# EAGLE design Blupill SCSI(a) (EAGLE 7.2.0)
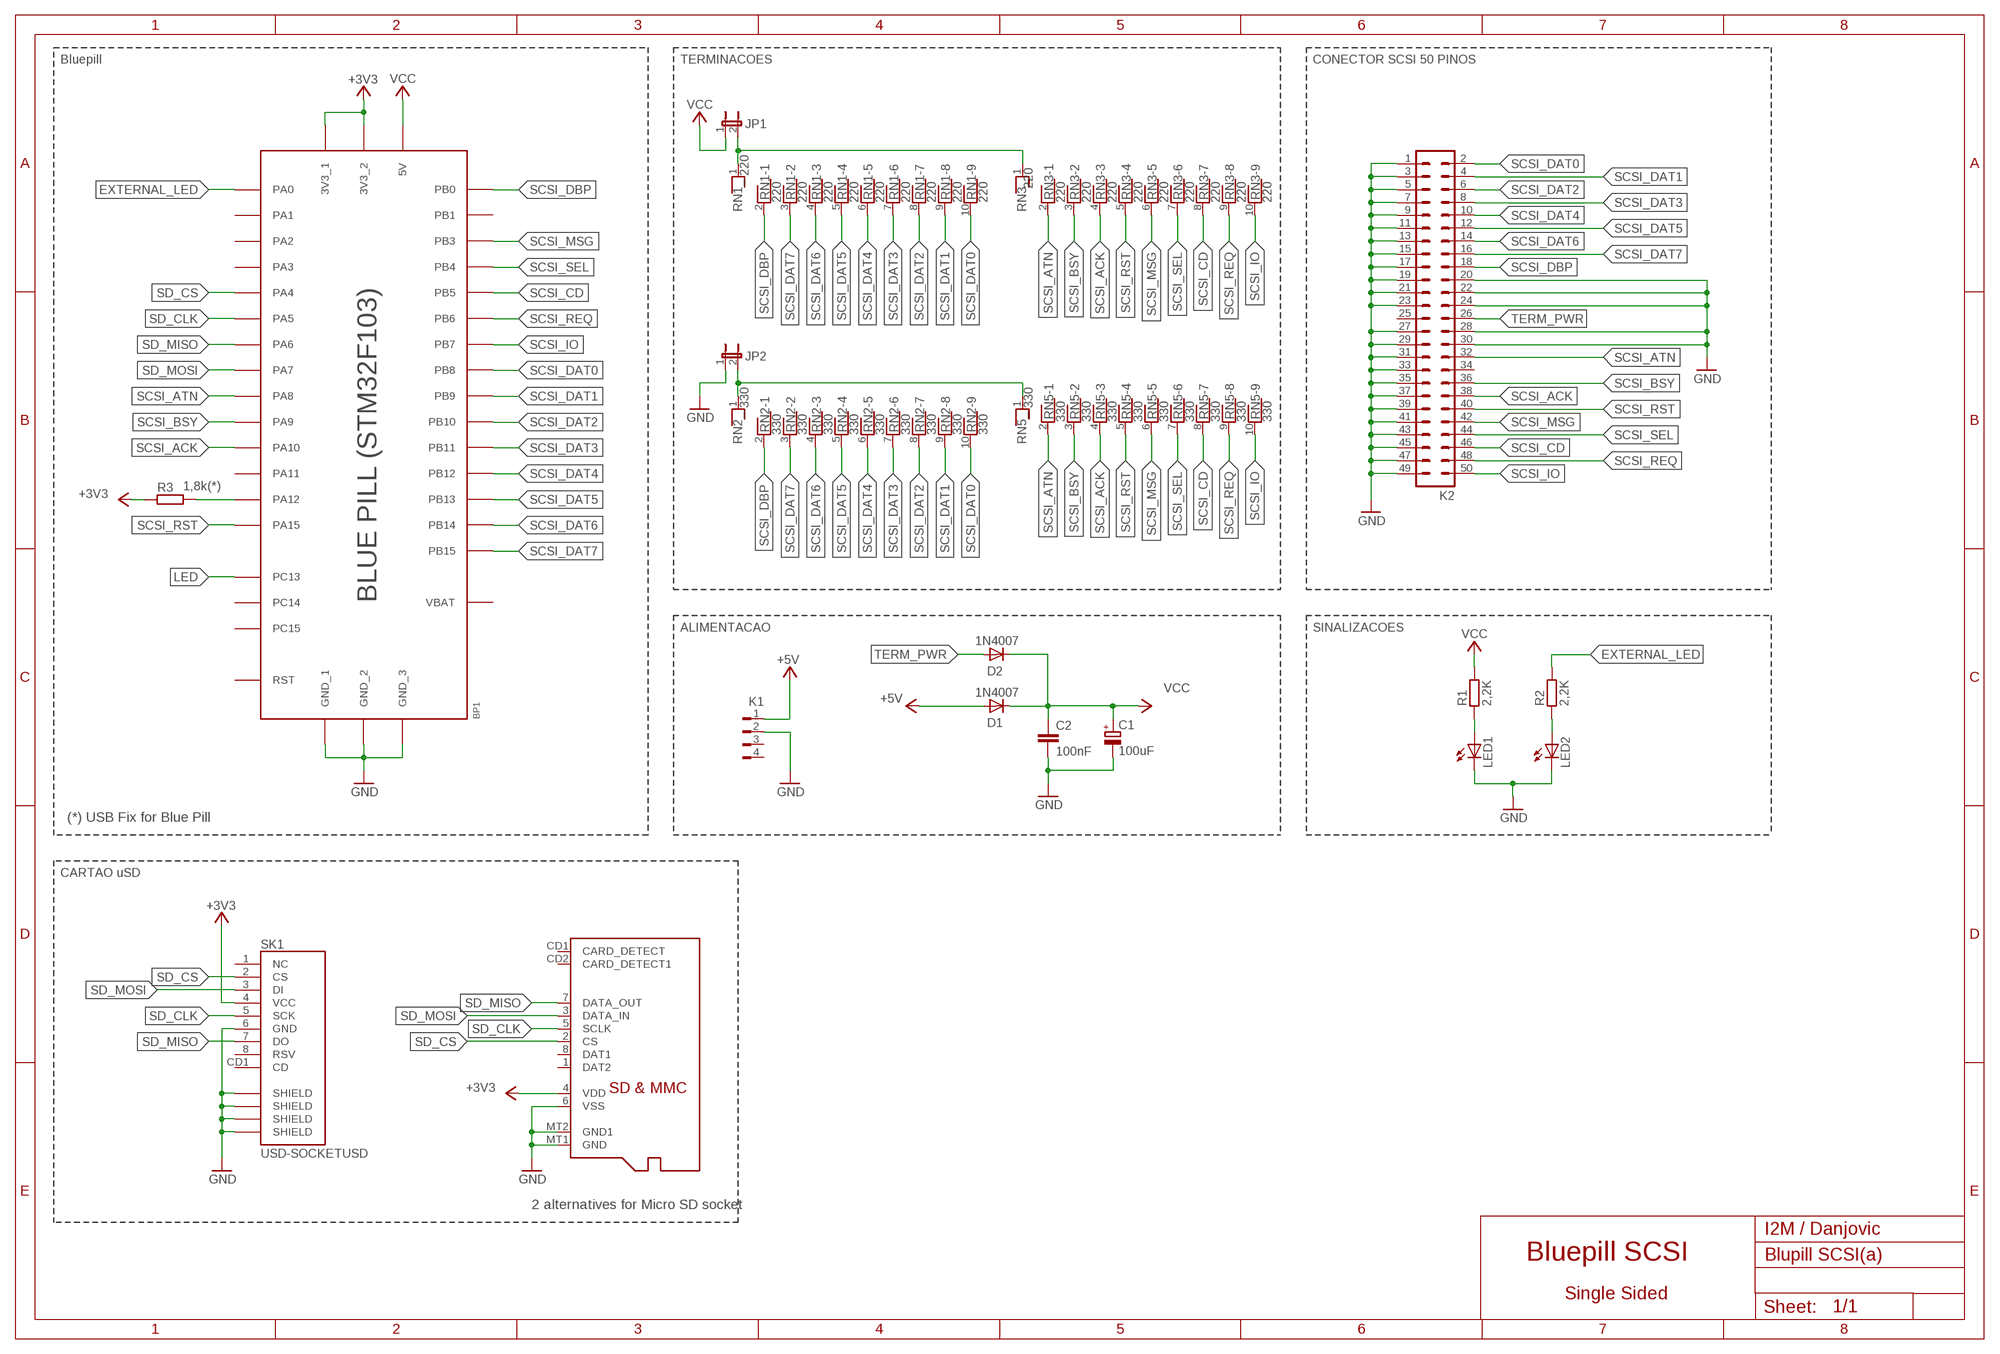
[diagram p0: schematic, sheet 1]

## Parts
BP1  BLUE_PILL  [BLUE_PILL]
C1  100uF  CPOL-EUE2.5-7  [E2,5-7]
C2  100nF  C-EU050-025X075  [C050-025X075]
D1  1N4007  1N4004  [DO41-10]
D2  1N4007  1N4004  [DO41-10]
JP1  JP1E  [JP1]
JP2  JP1E  [JP1]
K1  FLOP-4W  [FLOP-4V]
K2  ML50L  [ML50L]
LED1  LED3MM  [LED3MM]
LED2  LED3MM  [LED3MM]
R1  2,2K  R-EU_0207/10  [0207/10]
R2  2,2K  R-EU_0207/10  [0207/10]
R3  1,8k(*)  R-EU_0207/10  [0207/10]
RN1  220  RNX9  [RN-10]
RN2  330  RNX9  [RN-10]
RN3  220  RNX9  [RN-10]
RN5  330  RNX9  [RN-10]
SK1  USD-SOCKETUSD  [USD-SOCKET-PP]
U$2  MICROSD  [MICROSD]

## Nets
+3V3: BP1.3,3V_1(3V3_1) BP1.3,3V_2(3V3_2) R3.1 SK1.4(VCC) U$2.4(VDD)
+5V: D1.A K1.1
EXTERNAL_LED: BP1.A0 R2.2
GND: BP1.GND1(GND_1) BP1.GND2(GND_2) BP1.GND3(GND_3) C1.- C2.2 JP2.1 K1.2 K2.1 K2.3 K2.5 K2.7 K2.9 K2.11 K2.13 K2.15 K2.17 K2.19 K2.20 K2.21 K2.22 K2.23 K2.24 K2.27 K2.28 K2.29 K2.30 K2.31 K2.33 K2.35 K2.37 K2.39 K2.41 K2.43 K2.45 K2.47 K2.49 LED1.K(C) LED2.K(C) SK1.6(GND) SK1.GND1(SHIELD) SK1.GND2(SHIELD) SK1.GND3(SHIELD) SK1.GND4(SHIELD) U$2.6(VSS) U$2.MT1(GND) U$2.MT2(GND1)
LED: BP1.C13
N$1: JP2.2 RN2.1 RN5.1
N$2: LED1.A R1.1
N$3: LED2.A R2.1
N$4: JP1.2 RN1.1 RN3.1
N$5: BP1.A12 R3.2
SCSI_ACK: BP1.A10 K2.38 RN3.4 RN5.4
SCSI_ATN: BP1.A8 K2.32 RN3.2 RN5.2
SCSI_BSY: BP1.A9 K2.36 RN3.3 RN5.3
SCSI_CD: BP1.B5 K2.46 RN3.8 RN5.8
SCSI_DAT0: BP1.B8 K2.2 RN1.10 RN2.10
SCSI_DAT1: BP1.B9 K2.4 RN1.9 RN2.9
SCSI_DAT2: BP1.B10 K2.6 RN1.8 RN2.8
SCSI_DAT3: BP1.B11 K2.8 RN1.7 RN2.7
SCSI_DAT4: BP1.B12 K2.10 RN1.6 RN2.6
SCSI_DAT5: BP1.B13 K2.12 RN1.5 RN2.5
SCSI_DAT6: BP1.B14 K2.14 RN1.4 RN2.4
SCSI_DAT7: BP1.B15 K2.16 RN1.3 RN2.3
SCSI_DBP: BP1.B0 K2.18 RN1.2 RN2.2
SCSI_IO: BP1.B7 K2.50 RN3.10 RN5.10
SCSI_MSG: BP1.B3 K2.42 RN3.6 RN5.6
SCSI_REQ: BP1.B6 K2.48 RN3.9 RN5.9
SCSI_RST: BP1.A15 K2.40 RN3.5 RN5.5
SCSI_SEL: BP1.B4 K2.44 RN3.7 RN5.7
SD_CLK: BP1.A5 SK1.5(SCK) U$2.5(SCLK)
SD_CS: BP1.A4 SK1.2(CS) U$2.2(CS)
SD_MISO: BP1.A6 SK1.7(DO) U$2.7(DATA_OUT)
SD_MOSI: BP1.A7 SK1.3(DI) U$2.3(DATA_IN)
TERM_PWR: D2.A K2.26
VCC: BP1.5V C1.+ C2.1 D1.C D2.C JP1.1 R1.2
Unconnected: BP1.A1 BP1.A2 BP1.A3 BP1.A11 BP1.B1 BP1.C14 BP1.C15 BP1.RST K1.3 K1.4 K2.25 K2.34 SK1.1(NC) SK1.8(RSV) SK1.CD1(CD) U$2.1(DAT2) U$2.8(DAT1) U$2.CD1(CARD_DETECT) U$2.CD2(CARD_DETECT1)

## Notes on the sheet
- Bluepill | TERMINACOES | CONECTOR SCSI 50 PINOS
- ALIMENTACAO | SINALIZACOES
- (*) USB Fix for Blue Pill
- CARTAO uSD
- 2 alternatives for Micro SD socket
- I2M / Danjovic
- Bluepill SCSI
- Single Sided

## Power pins joined to a net without a drawn wire
VBAT: BP1.VB(VBAT)

## Library data of the parts
BP1 = _diversos:BLUE_PILL: Módulo de desenvolvimento Blue Pill.
C1 = rcl:CPOL-EU: POLARIZED CAPACITOR, European symbol
C2 = rcl:C-EU: CAPACITOR, European symbol
D1 D2 = diode:1N4004: DIODE general purpose rectifier, 1 A
JP1 JP2 = jumper:JP1E: JUMPER
K1 = con-amp:FLOP-4W: MATE N-LOCK Floppy / HDD conector Distributor: Bürklin 71F972
K2 = con-harting-ml:ML50: HARTING
LED1 LED2 = led:LED: LED OSRAM: - CHIPLED LG R971, LG N971, LY N971, LG Q971, LY Q971, LO R971, LY R971 LH N974, LH R974 LS Q976, LO Q976, LY Q976 LO Q996 - Hyper CHIPLED LW Q18S LB Q993, LB Q99A, LB R99A - SideLED LS A670, LO A670, LY A670, LG A670, LP A670 LB A673, LV A673, LT A673, LW A673 LH A674 LY A675 LS A676, LA A676, LO A676, LY A676, LW A676 LS A679, LY A679, LG A679 - Hyper Micro SIDELED® LS Y876, LA Y876, LO Y876, LY Y876 LT Y87S - SmartLED LW L88C, LW L88S LB L89C, LB L89S, LG L890 LS L89K, LO L89K, LY L89K LS L896, LA L896, LO L896, LY L896 - TOPLED LS T670, LO T670, LY T670, LG T670, LP T670 LSG T670, LSP T670, LSY T670, LOP T670, LYG T670 LG T671, LOG T671, LSG T671 LB T673, LV T673, LT T673, LW T673 LH T674 LS T676, LA T676, LO T676, LY T676, LB T676, LH T676, LSB T676, LW T676 LB T67C, LV T67C, LT T67C, LS T67K, LO T67K, LY T67K, LW E67C LS E67B, LA E67B, LO E67B, LY E67B, LB E67C, LV E67C, LT E67C LW T67C LS T679, LY T679, LG T679 LS T770, LO T770, LY T770, LG T770, LP T770 LB T773, LV T773, LT T773, LW T773 LH T774 LS E675, LA E675, LY E675, LS T675 LS T776, LA T776, LO T776, LY T776, LB T776 LHGB T686 LT T68C, LB T68C - Hyper Mini TOPLED® LB M676 - Mini TOPLED Santana® LG M470 LS M47K, LO M47K, LY M47K Source: http://www.osram.convergy.de LUXEON: - LUMILED® LXK2-PW12-R00, LXK2-PW12-S00, LXK2-PW14-U00, LXK2-PW14-V00 LXK2-PM12-R00, LXK2-PM12-S00, LXK2-PM14-U00 LXK2-PE12-Q00, LXK2-PE12-R00, LXK2-PE12-S00, LXK2-PE14-T00, LXK2-PE14-U00 LXK2-PB12-K00, LXK2-PB12-L00, LXK2-PB12-M00, LXK2-PB14-N00, LXK2-PB14-P00, LXK2-PB14-Q00 LXK2-PR12-L00, LXK2-PR12-M00, LXK2-PR14-Q00, LXK2-PR14-R00 LXK2-PD12-Q00, LXK2-PD12-R00, LXK2-PD12-S00 LXK2-PH12-R00, LXK2-PH12-S00 LXK2-PL12-P00, LXK2-PL12-Q00, LXK2-PL12-R00 Source: www.luxeon.com KINGBRIGHT: KA-3528ASYC Source: www.kingbright.com
R1-R3 = rcl:R-EU_: RESISTOR, European symbol
RN1-RN3 RN5 = resistor-net:RNX9: RESISTOR NETWORK
SK1 = _diversos:USD-SOCKET: Footprint do soquete para cartão uSD.
U$2 = adafruit:MICROSD: Micro-SD / Transflash card holder with SPI pinout For the 3M # 2908-05WB-MG and/or 4UCON #19656 push-push type

## Board
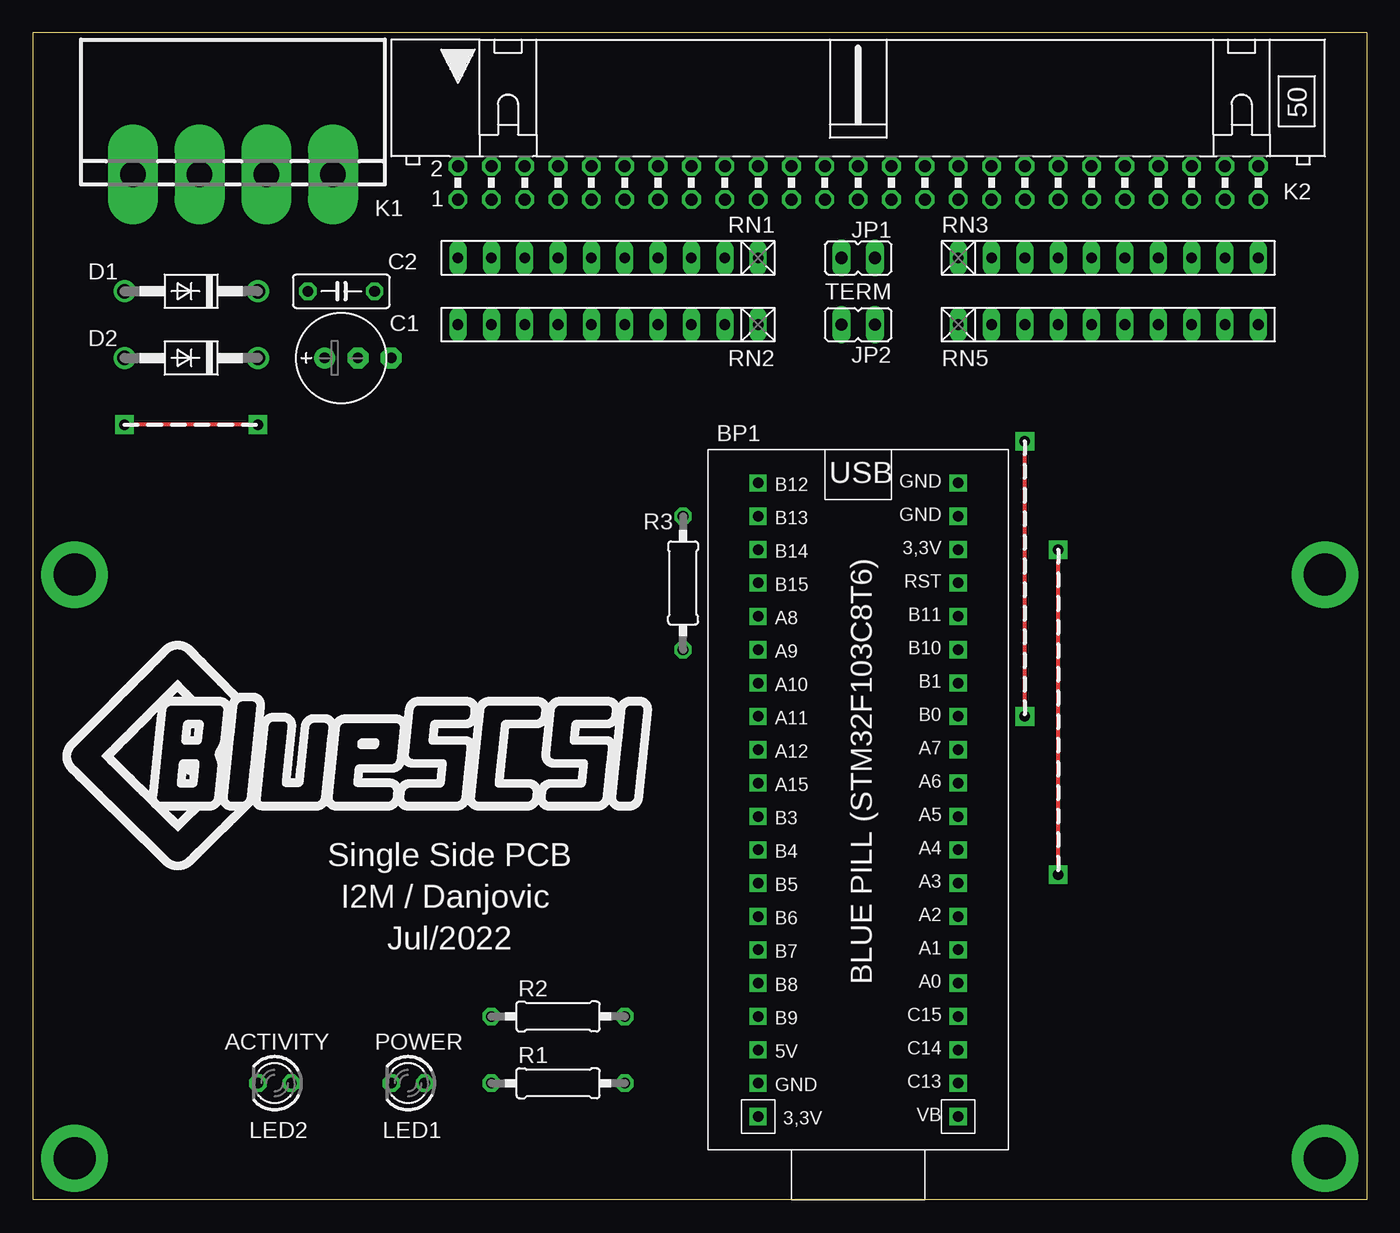
[diagram p1: board, top side]
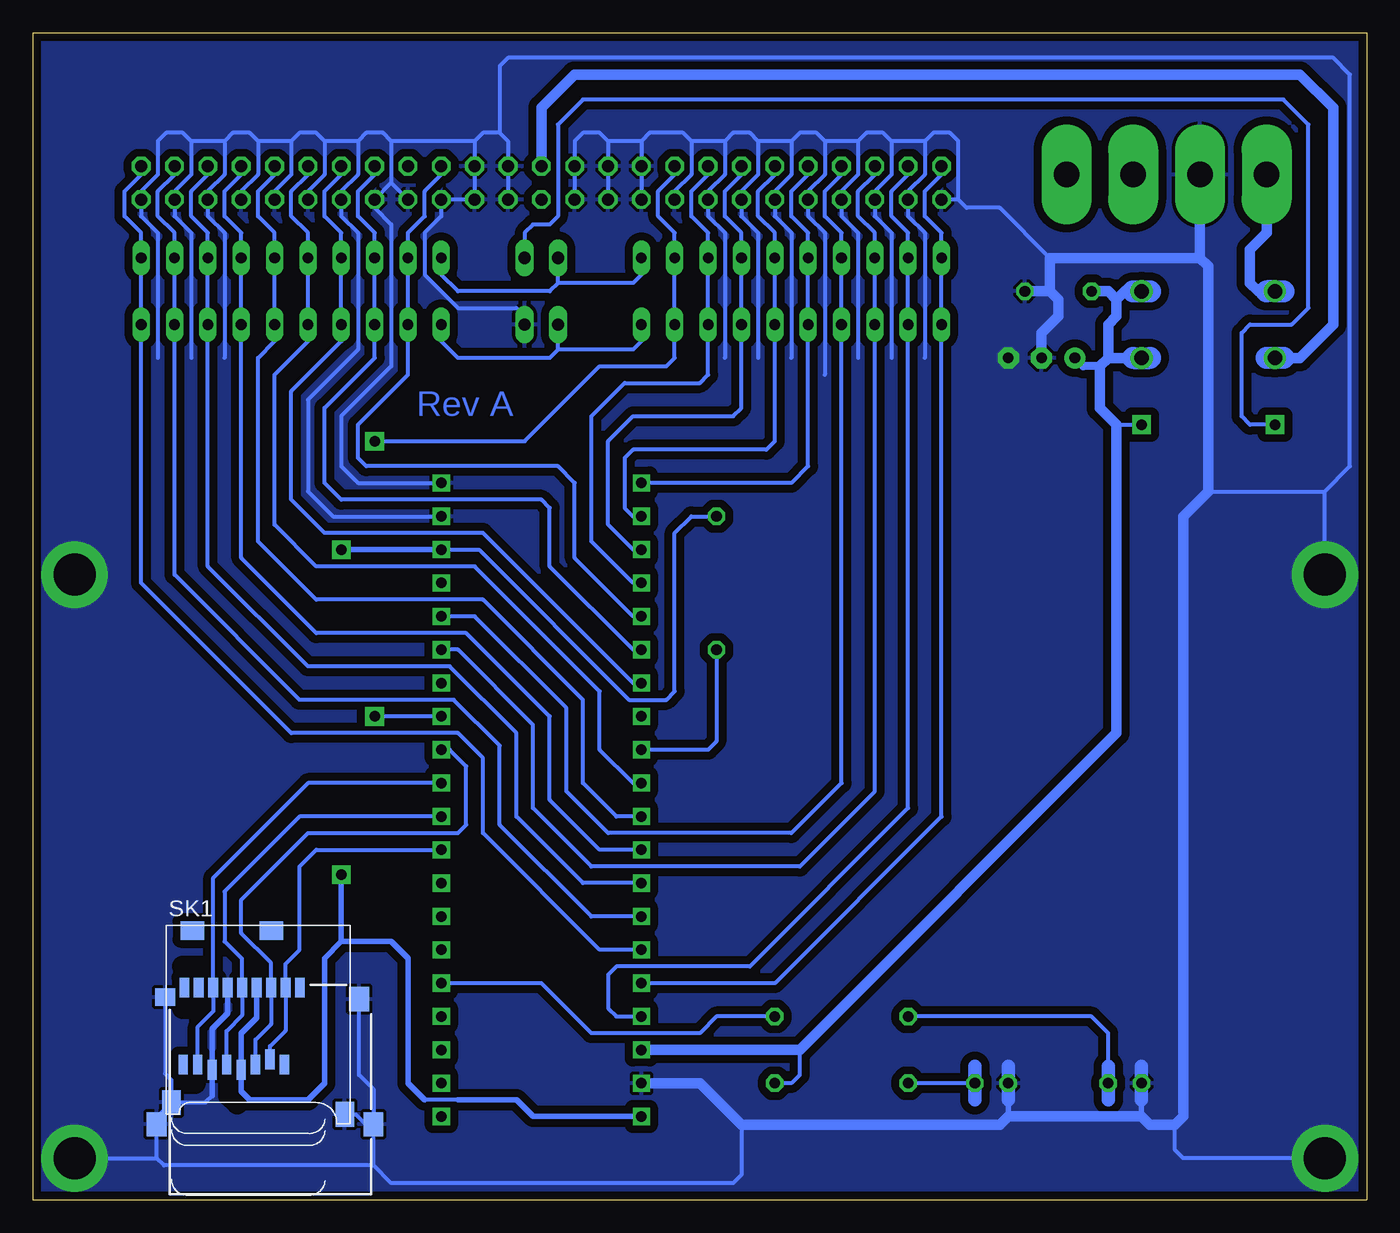
[diagram p2: board, bottom side, seen from below]

Size 101.6 x 88.9 mm. Coordinates in mm from the lower left corner, seen from the top.
Outline: 101.6,88.9 101.6,0 0,0 0,88.9 101.6,88.9
Copper layers (1*16): Top 0.035mm / dielectric 1.5mm / Bottom 0.035mm
Design rules "default *": minimum track width 10mil, minimum drill 24mil, track to track 8mil, track to pad 8mil, pad to pad 8mil, via to via 8mil, smd to smd 8mil, copper to edge 25mil, drill to drill 8mil, minimum pad ring 10mil, minimum via ring 8mil, stop-mask expansion 4mil, vias tented up to drill 0mil, thermal gap 10mil
bRestrict: 5 lines

### Footprints (pad centres in the part's own frame; a part is rotated, then mirrored left to right if it is on the bottom)
BLUE_PILL = drill 0.8 square: 3,3V_1 -19.05,7.62; 3,3V_2 24.13,-7.62; 5V 19.05,-7.62; A0 13.97,7.62; A1 11.43,7.62; A2 8.89,7.62; A3 6.35,7.62; A4 3.81,7.62; A5 1.27,7.62; A6 -1.27,7.62; A7 -3.81,7.62; A8 -13.97,-7.62; A9 -11.43,-7.62; A10 -8.89,-7.62; A11 -6.35,-7.62; A12 -3.81,-7.62; A15 -1.27,-7.62; B0 -6.35,7.62; B1 -8.89,7.62; B3 1.27,-7.62; B4 3.81,-7.62; B5 6.35,-7.62; B6 8.89,-7.62; B7 11.43,-7.62; B8 13.97,-7.62; B9 16.51,-7.62; B10 -11.43,7.62; B11 -13.97,7.62; B12 -24.13,-7.62; B13 -21.59,-7.62; B14 -19.05,-7.62; B15 -16.51,-7.62; C13 21.59,7.62; C14 19.05,7.62; C15 16.51,7.62; GND1 -24.13,7.62; GND2 -21.59,7.62; GND3 21.59,-7.62; RST -16.51,7.62; VB 24.13,7.62
E2,5-7 = drill 0.813 pad 1.6: + -1.27,0 | drill 0.813 pad 1.6 octagon: - 1.27,0
C050-025X075 = drill 0.813 octagon: 1 -2.54,0; 2 2.54,0
DO41-10 = drill 1.118: A 5.08,0; C -5.08,0
JP1 = drill 0.914 long: 1 0,-1.27; 2 0,1.27
FLOP-4V = drill 1.93 pad 3.81 long: 1 7.62,0; 2 2.54,0; 3 -2.54,0; 4 -7.62,0
ML50L = drill 0.914 octagon: 1 -30.48,-1.27; 2 -30.48,1.27; 3 -27.94,-1.27; 4 -27.94,1.27; 5 -25.4,-1.27; 6 -25.4,1.27; 7 -22.86,-1.27; 8 -22.86,1.27; 9 -20.32,-1.27; 10 -20.32,1.27; 11 -17.78,-1.27; 12 -17.78,1.27; 13 -15.24,-1.27; 14 -15.24,1.27; 15 -12.7,-1.27; 16 -12.7,1.27; 17 -10.16,-1.27; 18 -10.16,1.27; 19 -7.62,-1.27; 20 -7.62,1.27; 21 -5.08,-1.27; 22 -5.08,1.27; 23 -2.54,-1.27; 24 -2.54,1.27; 25 0,-1.27; 26 0,1.27; 27 2.54,-1.27; 28 2.54,1.27; 29 5.08,-1.27; 30 5.08,1.27; 31 7.62,-1.27; 32 7.62,1.27; 33 10.16,-1.27; 34 10.16,1.27; 35 12.7,-1.27; 36 12.7,1.27; 37 15.24,-1.27; 38 15.24,1.27; 39 17.78,-1.27; 40 17.78,1.27; 41 20.32,-1.27; 42 20.32,1.27; 43 22.86,-1.27; 44 22.86,1.27; 45 25.4,-1.27; 46 25.4,1.27; 47 27.94,-1.27; 48 27.94,1.27; 49 30.48,-1.27; 50 30.48,1.27
LED3MM = drill 0.813 octagon: A -1.27,0; K 1.27,0
0207/10 = drill 0.813 octagon: 1 -5.08,0; 2 5.08,0
RN-10 = drill 0.813 long: 1 -11.43,0; 2 -8.89,0; 3 -6.35,0; 4 -3.81,0; 5 -1.27,0; 6 1.27,0; 7 3.81,0; 8 6.35,0; 9 8.89,0; 10 11.43,0
USD-SOCKET-PP = smd 0.75 x 1.5: 1 1.93,7.91; 2 0.83,7.91; 3 -0.27,7.91; 4 -1.37,7.91; 5 -2.47,7.91; 6 -3.57,7.91; 7 -4.67,7.91; 8 -5.77,7.91; CD1 -6.87,7.91 | smd 1.5 x 1.35: GND1 -8.339,7.19 | smd 1.5 x 1.858: GND2 -8.974,-2.494; GND3 7.534,-2.494; GND4 6.434,7.04
MICROSD = smd 0.7 x 1.5: 1 9,-10.64; 2 7.9,-10.24; 3 6.8,-10.64; 4 5.7,-11.04; 5 4.6,-10.64; 6 3.5,-11.04; 7 2.4,-10.64; 8 1.3,-10.64 | smd 1.8 x 1.4: CD1 2,-0.44; CD2 8,-0.44 | smd 1.4 x 1.9: MT1 0.4,-13.54; MT2 13.6,-14.44

### Placement (x,y rotation side)
BP1  62.86,30.48 270 top
C1  23.5,64.14 0 top
C2  23.5,69.22 0 top
D1  12.07,69.22 180 top
D2  12.07,64.14 180 top
JP1  62.86,71.75 90 top
JP2  62.86,66.67 90 top
K1  15.24,78.11 180 top
K2  62.86,77.47 0 top
LED1  28.57,8.89 180 top
LED2  18.41,8.89 180 top
R1  40,8.89 0 top
R2  40,13.97 0 top
R3  49.53,46.99 270 top
RN1  43.81,71.75 180 top
RN2  43.81,66.67 180 top
RN3  81.91,71.75 0 top
RN5  81.91,66.67 0 top
SK1  83.19,8.25 0 bottom
U$2  91.44,20.96 0 bottom

### Tracks (layer width: path | path; a pad name or v marks a point on that pad's centre or on a via)
+3V3  (via drill 0.8 pad 1.42)
  Top 0.305: v78.11,24.77 v78.11,49.53
  Bottom 0.305: 69.22,7.62 71.75,7.62 | BP1.3,3V_1 67.63,49.53 56.2,38.1 53.34,38.1 52.7,38.73 52.7,50.8 51.43,52.07 R3.1
  Bottom 0.406: BP1.3,3V_2 63.5,6.35 64.77,7.62 69.22,7.62 | v78.11,49.53 BP1.3,3V_1 | 71.75,7.62 73.02,8.89 73.02,18.41 74.3,19.69 78.11,19.69 | 78.11,19.69 79.38,18.41 79.38,8.89 80.64,7.62 85.09,7.62 85.74,8.27 U$2.4 85.74,12.68 84.55,13.87 SK1.4 | v78.11,24.77 78.11,19.69
+5V
  Bottom 0.813: D1.A 8.25,69.22 8.89,69.85 8.89,72.39 7.62,73.66 K1.1
  Bottom 1.676: 6.35,69.22 D1.A 7.62,69.22
EXTERNAL_LED
  Bottom 0.305: BP1.A0 62.86,16.51 59.05,12.7 50.8,12.7 49.53,13.97 R2.2
GND  (via drill 0.8 pad 1.6, 3.2 pad 5.08)
  Bottom 0.305: 89.53,80.64 89.53,78.11 90.8,76.83 K2.47 90.8,74.93 89.53,73.66 89.53,64.14 | 86.99,80.64 86.99,78.11 88.27,76.83 K2.45 88.27,74.93 86.99,73.66 86.99,64.14 | K2.43 85.72,76.83 84.45,78.11 84.45,80.64 | 81.91,80.64 81.91,78.11 83.19,76.83 K2.41 | K2.39 80.64,76.83 79.38,78.11 79.38,80.64 | 76.83,80.64 76.83,78.11 78.11,76.83 K2.37 78.11,74.93 76.83,73.66 76.83,64.77 80.64,60.96 80.64,53.97 78.74,52.07 BP1.GND2 | 74.3,77.47 K2.35 75.56,75.56 74.3,74.3 74.3,63.5 78.11,59.69 78.11,55.88 76.83,54.61 BP1.GND1 | 74.3,80.64 74.3,77.47 | 74.3,77.47 K2.33 | K2.23 K2.24 60.32,80.64 59.69,81.28 58.42,81.28 57.78,80.64 | K2.21 K2.22 57.78,80.64 | K2.19 K2.20 55.24,80.64 | K2.27 K2.28 65.41,80.64 66.04,81.28 | 67.94,80.64 K2.30 K2.29 K2.31 70.48,74.93 71.75,73.66 71.75,70.48 69.22,67.94 64.77,67.94 64.14,67.31 JP2.1 | 55.24,80.64 57.78,80.64 | 55.24,80.64 54.61,81.28 52.07,81.28 51.43,80.64 | 48.89,80.64 51.43,80.64 | 48.89,80.64 48.26,81.28 46.99,81.28 46.35,80.64 | K2.17 52.7,76.83 51.43,78.11 51.43,80.64 | 48.89,80.64 48.89,78.11 50.16,76.83 K2.15 50.16,74.93 48.89,73.66 48.89,64.14 | 46.35,80.64 46.35,78.11 47.62,76.83 K2.13 47.62,74.93 46.35,73.66 46.35,64.14 | 43.81,80.64 43.81,78.11 45.08,76.83 K2.11 45.08,74.93 43.81,73.66 43.81,64.14 | 43.81,80.64 46.35,80.64 | 41.27,80.64 41.27,78.11 42.54,76.83 K2.9 42.54,74.93 41.27,73.66 41.27,62.86 | 41.27,80.64 41.91,81.28 43.18,81.28 43.81,80.64 | 38.73,80.64 38.73,78.11 40,76.83 K2.7 40,74.93 38.73,73.66 38.73,64.14 | 38.73,80.64 41.27,80.64 | 36.2,80.64 36.2,78.11 37.46,76.83 K2.5 37.46,74.93 36.2,73.66 36.2,64.14 | 36.2,80.64 36.83,81.28 38.1,81.28 38.73,80.64
  Bottom 0.305: 33.66,80.64 33.66,78.11 34.92,76.83 K2.3 34.92,74.93 33.66,73.66 33.66,64.14 | 33.66,80.64 36.2,80.64 | 31.12,76.2 K2.1 | 31.12,76.2 31.12,80.64 31.75,81.28 33.02,81.28 33.66,80.64 | 31.12,76.2 30.48,75.56 27.94,75.56 24.13,71.75 | SK1.GND4 76.75,9.52 75.65,8.43 SK1.GND3 | 47.62,5.71 47.62,1.9 48.26,1.27 74.3,1.27 75.65,2.63 | 66.04,81.28 67.31,81.28 67.94,80.64 | 67.94,80.64 74.3,80.64 | 74.3,80.64 74.93,81.28 76.2,81.28 76.83,80.64 | 76.83,80.64 79.38,80.64 | 79.38,80.64 80.01,81.28 81.28,81.28 81.91,80.64 | 81.91,80.64 84.45,80.64 | 84.45,80.64 85.09,81.28 86.36,81.28 86.99,80.64 | 86.99,80.64 89.53,80.64 | 89.53,80.64 90.17,81.28 91.44,81.28 92.08,80.64 92.08,78.11 93.34,76.83 K2.49 93.34,74.93 92.08,73.66 92.08,64.14 | 66.04,81.28 66.04,86.36 65.41,86.99 2.54,86.99 1.27,85.72 1.27,55.88 3.17,53.97 | 12.07,53.97 3.17,53.97 | v3.17,47.62 3.17,53.97 | v3.17,3.17 13.97,3.17 14.61,3.81 14.61,5.71 | U$2.MT2 77,6.51 76.25,5.76 SK1.GND3 | 75.65,2.63 SK1.GND3 | U$2.MT1 92.16,6.3 SK1.GND2 92.16,3.17 | 75.65,2.63 91.61,2.63 92.16,3.17 | v98.42,3.17 92.16,3.17 | SK1.GND1 91.52,9.61 91.04,9.12 U$2.MT1 | 87.94,7.94 88.47,7.42 U$2.MT1
  Bottom 0.406: 17.14,6.35 17.14,7.62 LED2.K | 27.3,6.35 27.3,7.62 LED1.K | SK1.6 86.75,14.21 87.94,13.02 U$2.6 87.94,7.94
  Bottom 0.813: 12.7,71.75 K1.2 | 24.13,69.22 24.13,71.75 12.7,71.75 | 24.13,69.22 C2.2 | C1.- 24.77,66.04 23.5,67.31 23.5,68.58 24.13,69.22 | BP1.GND3 50.8,8.89 47.62,5.71 27.94,5.71 27.3,6.35 17.14,6.35 16.51,5.71 14.61,5.71 13.97,6.35 13.97,52.07 12.07,53.97 12.07,71.12 12.7,71.75
  Bottom 1.016: 27.3,10.16 LED1.K 27.3,7.62 | 17.14,10.16 LED2.K 17.14,7.62
  other vias: 27.3,64.14 98.42,47.62
  pour Bottom (isolate 0.61): 101.6,0 0,0 0,88.9 101.6,88.9
N$1
  Bottom 0.305: RN5.1 70.48,65.41 69.22,64.14 62.23,64.14 61.59,64.77 | 61.59,64.77 55.88,64.77 55.24,65.41 RN2.1 | 61.59,64.77 JP2.2
N$2
  Bottom 0.305: LED1.A R1.1
  Bottom 1.016: 29.85,10.16 LED1.A 29.85,7.62
N$3
  Bottom 0.305: R2.1 20.96,13.97 19.69,12.7 19.69,10.16
  Bottom 1.016: 19.69,10.16 LED2.A 19.69,7.62
N$4
  Bottom 0.305: RN3.1 70.48,70.48 69.22,69.22 62.23,69.22 61.59,69.85 | 61.59,69.85 55.88,69.85 55.24,70.48 RN1.1 | 61.59,69.85 JP1.2
N$5
  Bottom 0.305: R3.2 49.53,34.92 50.16,34.29 BP1.A12
SCSI_ACK
  Bottom 0.305: K2.38 78.11,78.11 79.38,76.83 79.38,74.93 78.11,73.66 RN3.4 RN5.4 78.11,65.41 81.91,61.59 81.91,53.34 79.38,50.8 67.31,50.8 55.88,39.37 BP1.A10
SCSI_ATN
  Bottom 0.305: BP1.A8 55.88,44.45 60.32,48.89 60.32,54.61 61.59,55.88 76.2,55.88 76.83,56.52 76.83,59.05 73.02,62.86 RN5.2 RN3.2 73.02,73.66 71.75,74.93 71.75,76.83 70.48,78.11 K2.32
SCSI_BSY
  Bottom 0.305: BP1.A9 55.88,41.91 62.23,48.26 62.23,52.7 62.86,53.34 78.11,53.34 79.38,54.61 79.38,60.32 75.56,64.14 RN5.3 RN3.3 75.56,73.66 76.83,74.93 76.83,76.83 75.56,78.11 K2.36
SCSI_CD
  Bottom 0.305: BP1.B5 59.69,24.13 64.77,29.21 64.77,35.56 69.85,40.64 80.64,40.64 88.27,48.26 RN5.8 RN3.8 88.27,73.66 89.53,74.93 89.53,76.83 88.27,78.11 K2.46
SCSI_DAT0
  Bottom 0.305: BP1.B8 45.08,16.51 32.38,29.21 RN2.10 RN1.10 32.38,73.66 33.66,74.93 33.66,76.83 32.38,78.11 K2.2
SCSI_DAT1
  Bottom 0.305: BP1.B9 57.15,13.97 57.78,14.61 57.78,17.14 57.15,17.78 46.99,17.78 34.92,29.85 RN2.9 RN1.9 34.92,73.66 36.2,74.93 36.2,76.83 34.92,78.11 K2.4
SCSI_DAT2
  Bottom 0.305: BP1.B10 69.22,41.91 63.5,36.2 63.5,29.85 59.05,25.4 43.18,25.4 37.46,31.12 RN2.8 RN1.8 37.46,73.66 38.73,74.93 38.73,76.83 37.46,78.11 K2.6
SCSI_DAT3
  Bottom 0.305: BP1.B11 67.94,44.45 60.96,37.46 60.96,31.12 57.78,27.94 43.81,27.94 40,31.75 RN2.7 RN1.7 40,73.66 41.27,74.93 41.27,76.83 40,78.11 K2.8
SCSI_DAT4
  Bottom 0.305: BP1.B12 43.81,54.61 42.54,55.88 RN2.6 RN1.6 42.54,73.66 43.81,74.93 43.81,76.83 42.54,78.11 K2.10
SCSI_DAT5
  Bottom 0.305: BP1.B13 55.88,52.07 56.52,52.7 56.52,56.52 55.88,57.15 45.72,57.15 45.08,57.78 RN2.5 RN1.5 45.08,73.66 46.35,74.93 46.35,76.83 45.08,78.11 K2.12
SCSI_DAT6
  Bottom 0.305: BP1.B14 55.88,49.53 57.78,51.43 57.78,57.78 55.88,59.69 48.26,59.69 47.62,60.32 RN2.4 RN1.4 47.62,73.66 48.89,74.93 48.89,76.83 47.62,78.11 K2.14
SCSI_DAT7
  Bottom 0.305: BP1.B15 55.88,46.99 59.05,50.16 59.05,59.69 56.52,62.23 50.8,62.23 50.16,62.86 RN2.3 RN1.3 50.16,73.66 51.43,74.93 51.43,76.83 50.16,78.11 K2.16
SCSI_DBP  (via drill 0.8 pad 1.42)
  Top 0.305: v75.56,36.83 v75.56,57.78
  Bottom 0.305: BP1.B0 v75.56,36.83 | K2.18 52.7,78.11 53.97,76.83 53.97,74.93 52.7,73.66 RN1.2 RN2.2 52.7,64.14 53.34,63.5 58.42,63.5 64.14,57.78 v75.56,57.78
SCSI_IO
  Bottom 0.305: BP1.B7 58.42,19.05 67.31,27.94 67.31,33.66 69.22,35.56 81.91,35.56 93.34,46.99 RN5.10 RN3.10 93.34,73.66 94.61,74.93 94.61,76.83 93.34,78.11 K2.50
SCSI_MSG
  Bottom 0.305: BP1.B3 57.15,29.21 59.69,31.75 59.69,38.1 67.31,45.72 80.01,45.72 84.45,50.16 84.45,64.14 83.19,65.41 RN5.6 RN3.6 83.19,73.66 84.45,74.93 84.45,76.83 83.19,78.11 K2.42
SCSI_REQ
  Bottom 0.305: BP1.B6 59.05,21.59 66.04,28.57 66.04,34.61 69.53,38.1 81.28,38.1 90.8,47.62 RN5.9 RN3.9 90.8,73.66 92.08,74.93 92.08,76.83 90.8,78.11 K2.48
SCSI_RST
  Bottom 0.305: BP1.A15 55.88,31.75 58.42,34.29 58.42,38.73 67.94,48.26 80.01,48.26 83.19,51.43 83.19,62.86 80.64,65.41 RN5.5 RN3.5 80.64,73.66 81.91,74.93 81.91,76.83 80.64,78.11 K2.40
SCSI_SEL
  Bottom 0.305: BP1.B4 58.42,26.67 62.23,30.48 62.23,36.83 68.58,43.18 80.01,43.18 85.72,48.89 RN5.7 RN3.7 85.72,73.66 86.99,74.93 86.99,76.83 85.72,78.11 K2.44
SD_CLK
  Bottom 0.305: U$2.5 86.84,12.86 85.66,14.04 SK1.5 85.66,18.34 86.99,19.69 86.99,23.5 81.28,29.21 BP1.A5
SD_CS
  Bottom 0.305: U$2.2 83.54,11.71 82.36,12.89 SK1.2 82.36,17.98 81.28,19.05 81.28,25.4 80.01,26.67 BP1.A4
SD_MISO
  Bottom 0.305: U$2.7 89.04,13.2 87.86,14.38 SK1.7 87.86,24.54 80.64,31.75 BP1.A6
SD_MOSI
  Bottom 0.305: BP1.A7 69.85,34.29 68.58,33.02 68.58,28.57 69.22,27.94 80.64,27.94 85.72,22.86 85.72,20.32 83.45,18.05 SK1.3 83.45,13.38 84.64,12.2 U$2.3
TERM_PWR
  Bottom 0.813: 6.35,64.14 5.08,64.14 2.54,66.67 2.54,83.19 5.08,85.72 60.32,85.72 62.86,83.19 K2.26
  Bottom 1.676: 6.35,64.14 D2.A 7.62,64.14
VCC  (via drill 0.8 pad 1.42)
  Top 0.305: v17.14,59.05 v6.98,59.05
  Bottom 0.305: BP1.5V 50.8,11.43 | 43.18,11.43 43.18,9.52 43.81,8.89 R1.2 | JP1.1 64.14,73.66 63.5,74.3 62.23,74.3 61.59,74.93 61.59,81.91 59.69,83.82 6.35,83.82 4.45,81.91 4.45,67.94 5.71,66.67 8.89,66.67 9.52,66.04 9.52,59.69 8.89,59.05 v6.98,59.05 | 19.05,59.05 v17.14,59.05
  Bottom 0.61: 20.32,63.5 21.59,63.5 C1.+
  Bottom 0.813: C2.1 19.69,69.22 19.05,68.58 | 19.05,68.58 18.41,69.22 17.78,69.22 | 19.69,64.14 17.78,64.14 | 19.69,64.14 19.69,66.67 19.05,67.31 19.05,68.58 | 19.69,64.14 20.32,63.5 20.32,60.32 19.05,59.05 19.05,35.56 43.18,11.43 BP1.5V
  Bottom 1.676: 16.51,69.22 D1.C 17.78,69.22 | 16.51,64.14 D2.C 17.78,64.14

### Text on the board
Bottom: Rev A
tPlace: TERM | Single Side PCB | I2M / Danjovic | Jul/2022 | ACTIVITY | POWER